# EAGLE design tinymac (EAGLE 7.1.0)
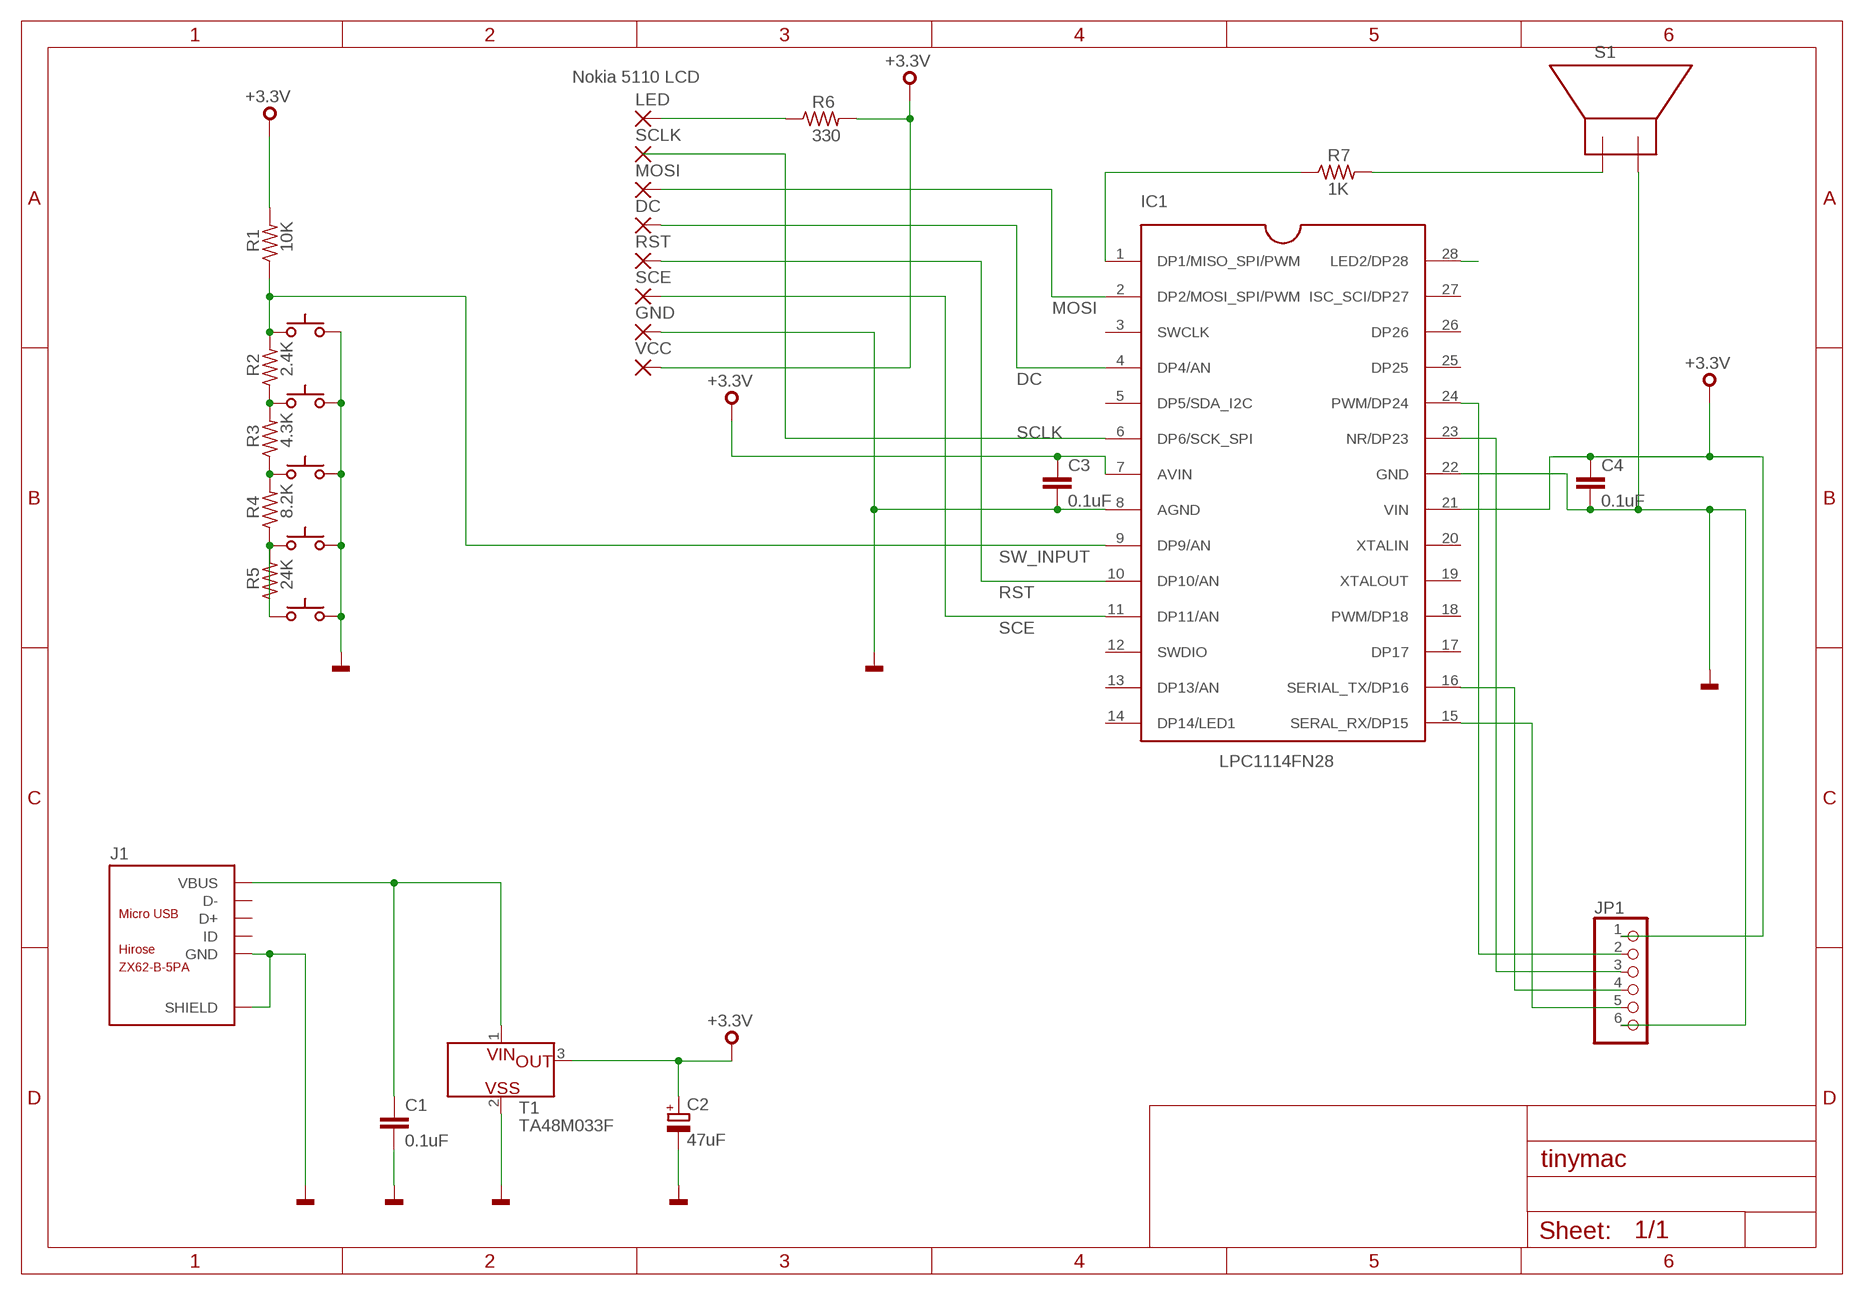
[diagram p0: schematic, sheet 1]

## Parts
C1  0.1uF  CAPACITOR25  [C025-024X044]
C2  47uF  CPOL-EUE2.5-5  [E2,5-5]
C3  0.1uF  CAPACITOR25  [C025-024X044]
C4  0.1uF  CAPACITOR25  [C025-024X044]
DC  HOLE_PAD  [HOLE_PAD]
GND  HOLE_PAD  [HOLE_PAD]
IC1  LPC1114FN28  [DIP28]
J1  ZX62-B-5PA  [ZX62-B-5PA(11)]
JP1  PINHD-1X6_2.54  [1X06]
LED  HOLE_PAD  [HOLE_PAD]
MOSI  HOLE_PAD  [HOLE_PAD]
R1  10K  REGISTOR2V  [0207/2V]
R2  2.4K  REGISTOR2V  [0207/2V]
R3  4.3K  REGISTOR2V  [0207/2V]
R4  8.2K  REGISTOR2V  [0207/2V]
R5  24K  REGISTOR2V  [0207/2V]
R6  330  REGISTOR2V  [0207/2V]
R7  1K  REGISTOR2V  [0207/2V]
RST  HOLE_PAD  [HOLE_PAD]
S1  PKM13EPYH4000  [PKM13EPYH4000]
SCE  HOLE_PAD  [HOLE_PAD]
SCLK  HOLE_PAD  [HOLE_PAD]
SW1  TACT_SW  [TACT_SW]
SW2  TACT_SW  [TACT_SW]
SW3  TACT_SW  [TACT_SW]
SW4  TACT_SW  [TACT_SW]
SW5  TACT_SW  [TACT_SW]
T1  TA48M033F  [TA48M033F]
VCC  HOLE_PAD  [HOLE_PAD]

## Nets
+3.3V [3.3V]: C2.+ C3.1 C4.1 IC1.7(AVIN) IC1.21(VIN) JP1.1 R1.2 R6.2 T1.3(OUT) VCC.1(P)
DC: DC.1(P) IC1.4(DP4/AN)
GND [GND]: C1.2 C2.- C3.2 C4.2 GND.1(P) IC1.8(AGND) IC1.22(GND) J1.5(GND) J1.SH1(SHIELD) J1.SH2(SHIELD) J1.SH3(SHIELD) J1.SH4(SHIELD) J1.SH5(SHIELD) J1.SH6(SHIELD) JP1.6 S1.2 SW1.1-B SW1.2-B SW2.1-B SW2.2-B SW3.1-B SW3.2-B SW4.1-B SW4.2-B SW5.1-B SW5.2-B T1.2(VSS)
MOSI: IC1.2(DP2/MOSI_SPI/PWM) MOSI.1(P)
N$1: IC1.15(SERAL_RX/DP15) JP1.5
N$2: R2.2 R3.2 SW2.1-A SW2.2-A
N$3: IC1.16(SERIAL_TX/DP16) JP1.4
N$6: R3.1 R4.2 SW3.1-A SW3.2-A
N$7: R4.1 R5.1 SW4.1-A SW4.2-A
N$8: R5.2 SW5.1-A SW5.2-A
N$11: IC1.28(LED2/DP28)
N$13: IC1.1(DP1/MISO_SPI/PWM) R7.1
N$16: R7.2 S1.1
N$17: IC1.24(PWM/DP24) JP1.2
N$18: IC1.23(NR/DP23) JP1.3
N$19 [3.3V]: LED.1(P) R6.1
RST: IC1.10(DP10/AN) RST.1(P)
SCE: IC1.11(DP11/AN) SCE.1(P)
SCLK: IC1.6(DP6/SCK_SPI) SCLK.1(P)
SW_INPUT: IC1.9(DP9/AN) R1.1 R2.1 SW1.1-A SW1.2-A
VBUS [5V]: C1.1 J1.1(VBUS) T1.1(VIN)
Unconnected: IC1.3(SWCLK) IC1.5(DP5/SDA_I2C) IC1.12(SWDIO) IC1.13(DP13/AN) IC1.14(DP14/LED1) IC1.17(DP17) IC1.18(PWM/DP18) IC1.19(XTALOUT) IC1.20(XTALIN) IC1.25(DP25) IC1.26(DP26) IC1.27(ISC_SCI/DP27) J1.2(D-) J1.3(D+) J1.4(ID)

## Notes on the sheet
- Nokia 5110 LCD
- LPC1114FN28

## Library data of the parts
C1 C3 C4 = tinymac:CAPACITOR: CAPACITOR
C2 = tinymac:CPOL-EU: POLARIZED CAPACITOR, European symbol
DC GND LED MOSI RST SCE SCLK VCC = tinymac2:HOLE_PAD: THROUGH-HOLE PAD
IC1 = tinymac:LPC1114FN28
J1 = macklock:ZX62-B-5PA
JP1 = maclock2:PINHD-1X6: PIN HEADER
R1-R6 = tinymac:REGISTOR: REGISTOR
R7 = maclock:REGISTOR: REGISTOR
S1 = tinymac:PKM13EPYH4000: SPEAKER http://akizukidenshi.com/catalog/g/gP-04118/
SW1-SW5 = tinymac:TACT_SW: normal tact switch
T1 = tinymac:TA48M033F

## Net classes
0 default: width 0.254 mm
1 5V: width 0.406 mm
2 3.3V: width 0.406 mm
3 GND: width 0.406 mm

## Board
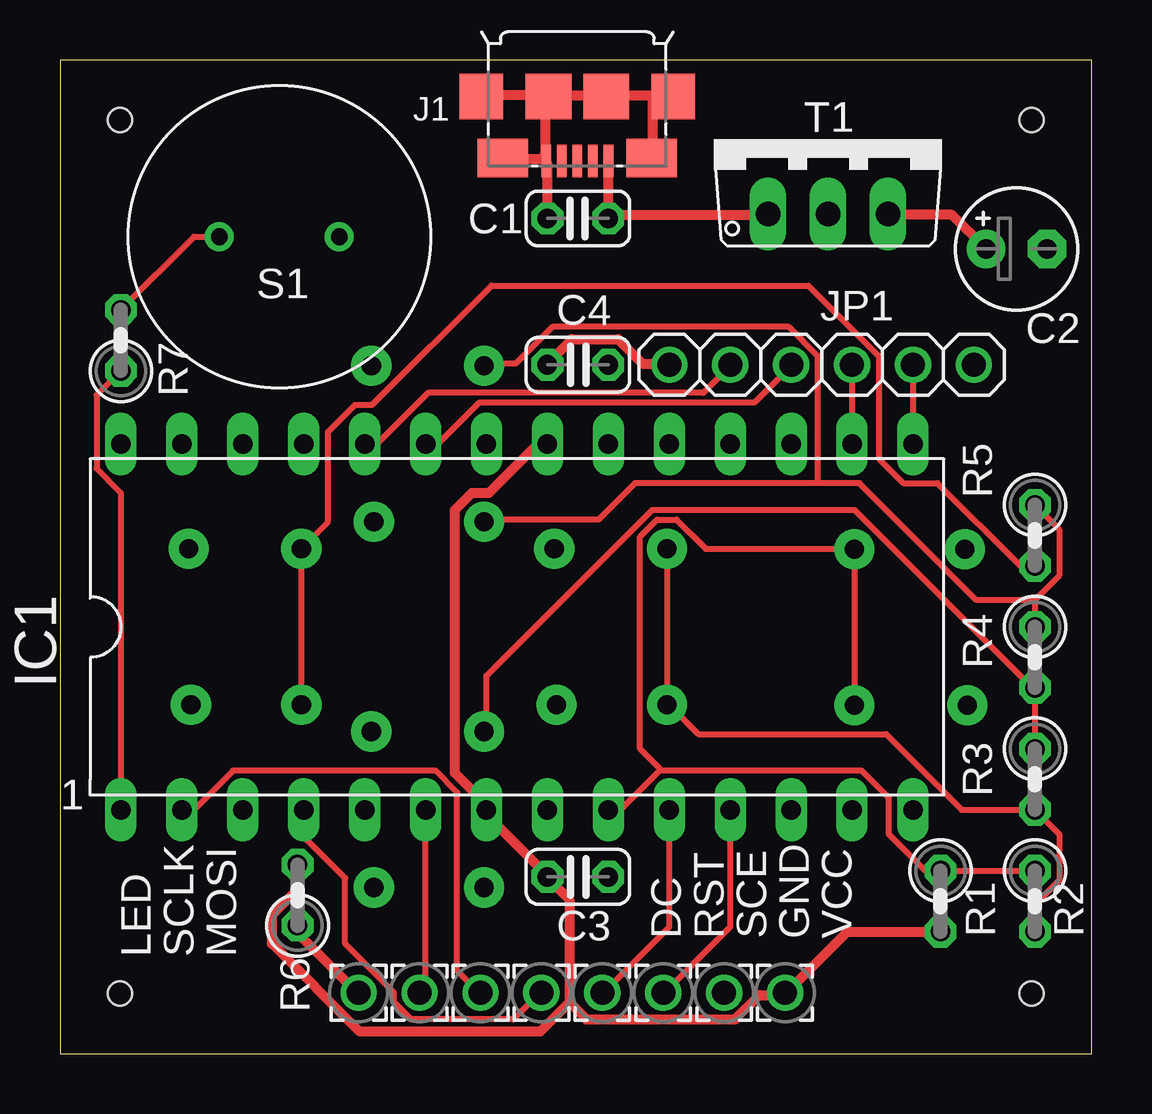
[diagram p1: board, top side]
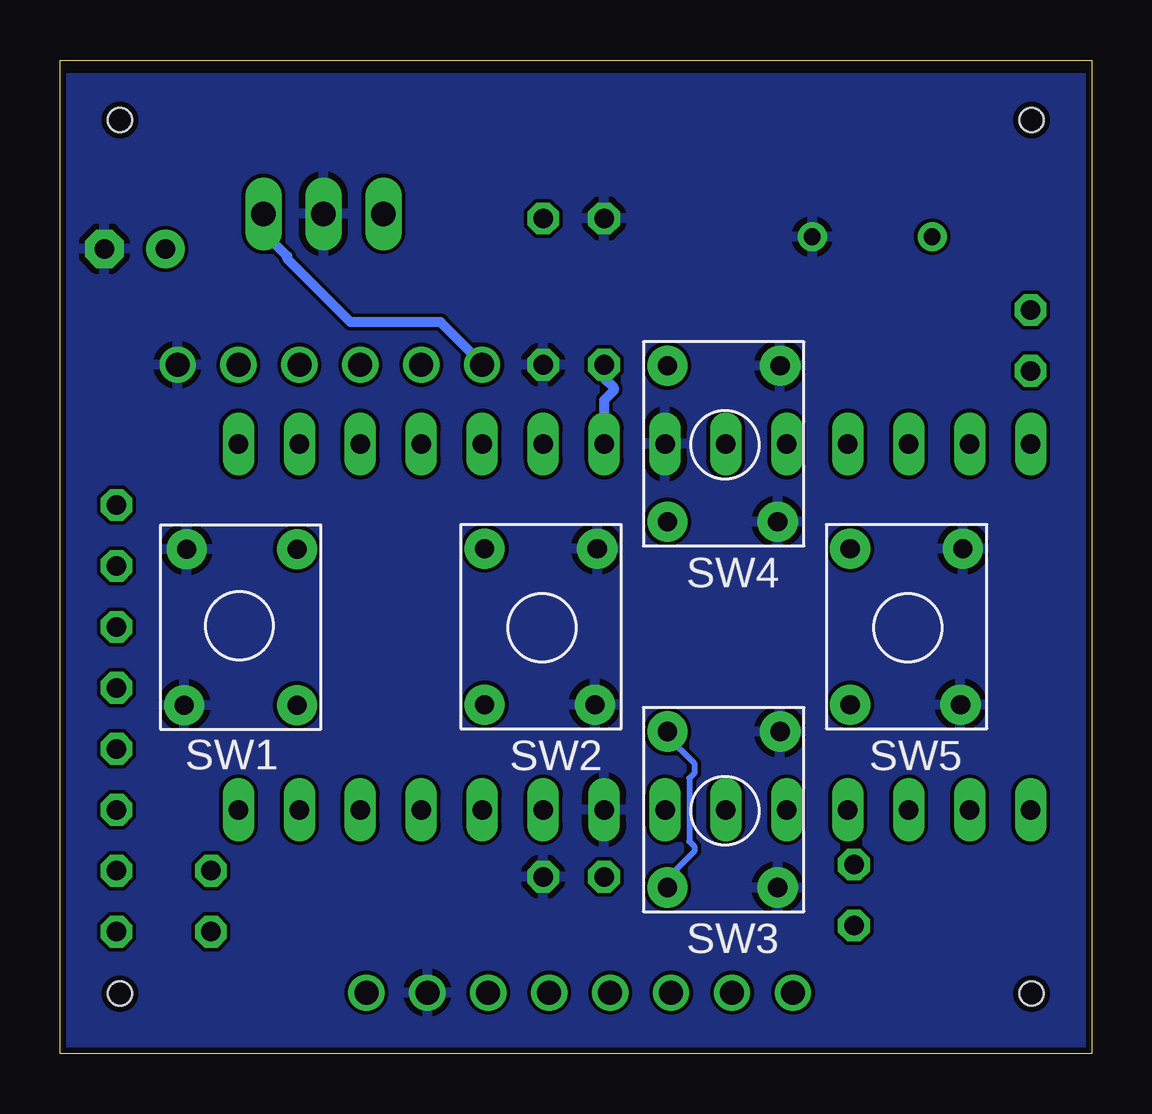
[diagram p2: board, bottom side, seen from below]

Size 43 x 41.4 mm. Coordinates in mm from the lower left corner, seen from the top.
Outline: 0,0 43,0 43,41.4 0,41.4 0,0
Copper layers (1*16): Top 0.035mm / dielectric 1.5mm / Bottom 0.035mm
Design rules "SeeedStudio_2layer_DRU_no_angle_20140221": minimum track width 6mil, minimum drill 12mil, track to track 6mil, track to pad 6mil, pad to pad 6mil, via to via 6mil, smd to smd 0mil, copper to edge 10mil, drill to drill 10mil, minimum pad ring 10mil, minimum via ring 6mil, stop-mask expansion 2mil, vias tented up to drill 100mil, thermal gap 10mil
Holes 1 mm at 2.5,2.5 40.5,2.5 2.5,38.9 40.5,38.9
tRestrict: area 1,1 to 4,4; area 39,1 to 42,4; area 39,37.4 to 42,40.4; area 1,37.4 to 4,40.4

### Footprints (pad centres in the part's own frame; a part is rotated, then mirrored left to right if it is on the bottom)
C025-024X044 = drill 0.813 octagon: 1 -1.27,0; 2 1.27,0
E2,5-5 = drill 0.813 pad 1.6: + -1.27,0 | drill 0.813 pad 1.6 octagon: - 1.27,0
HOLE_PAD = drill 1: 1 0,0
DIP28 = drill 0.813 long: 1 -16.51,-7.62; 2 -13.97,-7.62; 3 -11.43,-7.62; 4 -8.89,-7.62; 5 -6.35,-7.62; 6 -3.81,-7.62; 7 -1.27,-7.62; 8 1.27,-7.62; 9 3.81,-7.62; 10 6.35,-7.62; 11 8.89,-7.62; 12 11.43,-7.62; 13 13.97,-7.62; 14 16.51,-7.62; 15 16.51,7.62; 16 13.97,7.62; 17 11.43,7.62; 18 8.89,7.62; 19 6.35,7.62; 20 3.81,7.62; 21 1.27,7.62; 22 -1.27,7.62; 23 -3.81,7.62; 24 -6.35,7.62; 25 -8.89,7.62; 26 -11.43,7.62; 27 -13.97,7.62; 28 -16.51,7.62
ZX62-B-5PA(11) = smd 0.4 x 1.35: 1 -1.3,2.675; 2 -0.65,2.675; 3 0,2.675; 4 0.65,2.675; 5 1.3,2.675 | smd 2.1 x 1.6: SH1 -3.1,2.55; SH2 3.1,2.55 | smd 1.8 x 1.9: SH3 -4,0; SH6 4,0 | smd 1.9 x 1.9: SH4 -1.2,0; SH5 1.2,0
1X06 = drill 1: 1 -6.35,0; 2 -3.81,0; 3 -1.27,0; 4 1.27,0; 5 3.81,0; 6 6.35,0
0207/2V = drill 0.813 octagon: 1 -1.27,0; 2 1.27,0
PKM13EPYH4000 = drill 0.7: 1 -2.5,0; 2 2.5,0
TACT_SW = drill 0.8 pad 1.676: 1-A -2.44,-3.24; 1-B 2.16,-3.24; 2-A -2.44,3.26; 2-B 2.26,3.26
TA48M033F = drill 1.016 long: 1 -2.5,-3.1; 2 0,-3.1; 3 2.5,-3.1

### Placement (x,y rotation side)
C1  21.59,34.8 180 top
C2  39.88,33.53 0 top
C3  21.59,7.37 0 top
C4  21.59,28.7 0 top
DC  20.07,2.54 90 top
GND  27.69,2.54 90 top
IC1  19.05,17.78 0 top
J1  21.56,39.88 180 top
JP1  31.75,28.7 0 top
LED  12.45,2.54 90 top
MOSI  17.53,2.54 90 top
R1  36.7,6.35 270 top
R2  40.64,6.35 270 top
R3  40.64,11.43 270 top
R4  40.64,16.51 270 top
R5  40.64,21.59 270 top
R6  9.91,6.6 90 top
R7  2.54,29.72 90 top
RST  22.61,2.54 90 top
S1  9.14,34.04 0 top
SCE  25.15,2.54 90 top
SCLK  14.99,2.54 90 top
SW1  35.56,17.78 180 bottom
SW2  22.86,17.78 0 bottom
SW3  15.24,10.16 0 bottom
SW4  15.24,25.4 0 bottom
SW5  7.62,17.78 0 bottom
T1  32.02,38.09 0 top
VCC  30.23,2.54 90 top

### Tracks (layer width: path | path; a pad name or v marks a point on that pad's centre or on a via)
+3.3V
  Top 0.406: C2.+ 37.19,34.95 34.54,34.95 T1.3 | JP1.1 25.4,28.75 24.28,28.75 23.27,29.77 21.34,29.77 20.32,28.75 C4.1 | R1.2 32.82,5.08 30.28,2.54 VCC.1 30.07,2.44 29.16,2.44 28.14,1.42 21.95,1.42 21.23,2.13 | 21.23,2.13 20.02,0.91 12.5,0.91 8.84,4.57 8.84,5.79 9.86,6.81 9.86,7.82 R6.2 | 21.23,2.13 21.23,6.4 20.32,7.32 C3.1 20.22,7.52 17.78,9.96 IC1.7 17.88,10.26 16.46,11.68 16.46,22.66 17.17,23.37 17.88,23.37 19.91,25.4 IC1.21
  Bottom 0.406: IC1.21 20.32,27.23 19.91,27.64 19.91,27.74 20.32,28.14 C4.1 | T1.3 34.44,34.95 34.44,34.14 33.53,33.22 33.53,33.12 30.89,30.48 27.13,30.48 25.4,28.75 JP1.1
DC
  Top 0.254: IC1.4 10.16,9.04 11.89,7.32 11.89,4.57 13.92,2.54 13.92,2.13 14.63,1.42 18.9,1.42 20.02,2.54 DC.1
GND
  Top 0.406: J1.5 20.22,37.29 18.49,37.29 J1.SH2 | C1.2 20.32,37.08 J1.5 | J1.SH6 17.58,39.93 20.32,39.93 J1.SH5 | J1.SH5 20.52,39.93 22.76,39.93 J1.SH4 22.96,39.93 25.5,39.93 J1.SH3 24.69,39.83 24.69,37.39 J1.SH1 | J1.5 20.22,37.49 20.22,39.73 J1.SH5
  pour Bottom: 0,40.64 43.18,40.64 43.18,0 0,0
MOSI
  Top 0.254: IC1.2 5.59,10.16 7.21,11.79 15.65,11.79 16.56,10.87 16.56,3.45 17.48,2.54 MOSI.1
N$1
  Top 0.254: JP1.5 IC1.15
N$2
  Top 0.254: R2.2 40.64,6.2 41.66,7.21 41.66,9.14 R3.2 37.59,10.16 34.44,13.31 26.62,13.31 25.4,14.53 SW2.1-A 25.3,14.63 SW2.2-A
N$3
  Top 0.254: JP1.4 IC1.16
N$6
  Top 0.254: R3.1 R4.2 40.54,15.24 33.12,22.66 24.69,22.66 17.78,15.75 17.78,13.51 SW3.2-A
  Bottom 0.254: SW3.1-A 17.68,7.01 17.68,7.32 16.56,8.43 16.56,8.64 16.76,8.84 16.76,11.48 16.56,11.68 16.56,12.09 17.68,13.21 SW3.2-A
N$7
  Top 0.254: 40.64,18.9 R4.1 | 40.64,18.9 41.66,19.91 41.66,21.84 R5.1 | 31.6,23.77 33.33,23.77 38.2,18.9 40.64,18.9 | 31.6,23.77 23.98,23.77 22.45,22.25 17.78,22.25 SW4.1-A | 31.6,23.77 31.6,29.06 30.38,30.28 20.52,30.28 19,28.75 17.78,28.75 SW4.2-A
N$8
  Top 0.254: R5.2 40.03,20.32 36.58,23.77 35.15,23.77 34.14,24.79 34.14,29.06 31.19,32 17.98,32 13.01,27.03 12.29,27.03 11.18,25.91 11.18,22.15 10.16,21.13 SW5.2-A 10.06,20.93 10.06,14.63 SW5.1-A
N$13
  Top 0.254: IC1.1 2.54,23.37 1.52,24.38 1.52,27.43 R7.1
N$16
  Top 0.254: S1.1 5.59,34.04 R7.2
N$17
  Top 0.254: IC1.24 13.21,25.4 15.34,27.53 26.82,27.53 27.94,28.65 JP1.2
N$18
  Top 0.254: IC1.23 15.75,25.4 17.48,27.13 28.96,27.13 30.48,28.65 JP1.3
N$19
  Top 0.406: R6.1 9.96,5.28 9.96,4.98 12.39,2.54 LED.1
RST
  Top 0.254: IC1.10 25.4,5.28 22.66,2.54 RST.1
SCE
  Top 0.254: IC1.11 27.94,5.28 25.2,2.54 SCE.1
SCLK
  Top 0.254: IC1.6 15.24,2.74 15.04,2.54 SCLK.1
SW_INPUT
  Top 0.254: SW1.2-A 33.12,20.93 SW1.1-A 33.02,21.03 26.92,21.03 25.7,22.25 24.89,22.25 24.18,21.54 24.18,12.7 24.99,11.89 24.99,11.79 | IC1.9 23.37,10.16 24.99,11.79 | 24.99,11.79 33.43,11.79 34.54,10.67 34.54,9.14 36.07,7.62 R1.1 R2.1
VBUS
  Top 0.406: J1.1 22.86,37.19 C1.1 22.96,34.95 29.46,34.95 T1.1